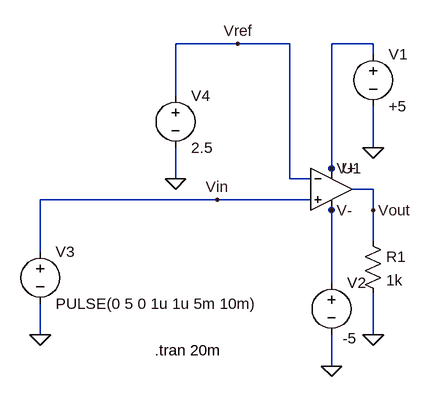
[diagram p0: schematic Comparator.asc]
Comparator.asc, the LTspice schematic file:
Version 4.1
SHEET 1 880 680
WIRE 96 -368 0 -368
WIRE 176 -368 96 -368
WIRE 304 -368 240 -368
WIRE 304 -352 304 -368
WIRE 0 -288 0 -368
WIRE 304 -208 304 -272
WIRE 240 -176 240 -368
WIRE 0 -160 0 -208
WIRE 176 -160 176 -368
WIRE 208 -160 176 -160
WIRE 240 -160 240 -176
WIRE 304 -144 272 -144
WIRE 64 -128 -208 -128
WIRE 208 -128 64 -128
WIRE 240 -112 240 -128
WIRE 304 -112 304 -144
WIRE 304 -64 304 -112
WIRE -208 -48 -208 -128
WIRE 240 0 240 -112
WIRE -208 80 -208 32
WIRE 304 80 304 16
WIRE 240 128 240 80
FLAG 304 80 0
FLAG 240 -176 V+
FLAG 240 -112 V-
FLAG 304 -208 0
FLAG 0 -160 0
FLAG -208 80 0
FLAG 240 128 0
FLAG 64 -128 Vin
FLAG 96 -368 Vref
FLAG 304 -112 Vout
SYMBOL voltage -208 -64 R0
WINDOW 123 0 0 Left 0
WINDOW 39 0 0 Left 0
SYMATTR InstName V3
SYMATTR Value PULSE(0 5 0 1u 1u 5m 10m)
SYMBOL voltage 0 -304 R0
WINDOW 123 0 0 Left 0
WINDOW 39 0 0 Left 0
SYMATTR InstName V4
SYMATTR Value 2.5
SYMBOL res 288 -80 R0
SYMATTR InstName R1
SYMATTR Value 1k
SYMBOL voltage 304 -368 R0
WINDOW 123 0 0 Left 0
WINDOW 39 0 0 Left 0
SYMATTR InstName V1
SYMATTR Value +5
SYMBOL voltage 240 -16 R0
WINDOW 3 17 101 Left 2
WINDOW 123 0 0 Left 0
WINDOW 39 0 0 Left 0
SYMATTR InstName V2
SYMATTR Value -5
SYMBOL OpAmps\\UniversalOpAmp2 240 -144 R0
SYMATTR InstName U1
TEXT -32 104 Left 2 !.tran 20m

The netlist it stands for:
* Comparator.asc
V3 Vin 0 PULSE(0 5 0 1u 1u 5m 10m)
V4 Vref 0 2.5
R1 Vout 0 1k
V1 V+ 0 +5
V2 V- 0 -5
X§U1 Vin Vref V+ V- Vout level2 Avol=1Meg GBW=10Meg Slew=10Meg Ilimit=25m Rail=0 Vos=0 En=0 Enk=0 In=0 Ink=0 Rin=500Meg  ; pins In+ In- V+ V- OUT
.tran 20m
.lib UniversalOpAmp2.lib
.backanno
.end